# EAGLE design nixie-clock (EAGLE 9.6.0)
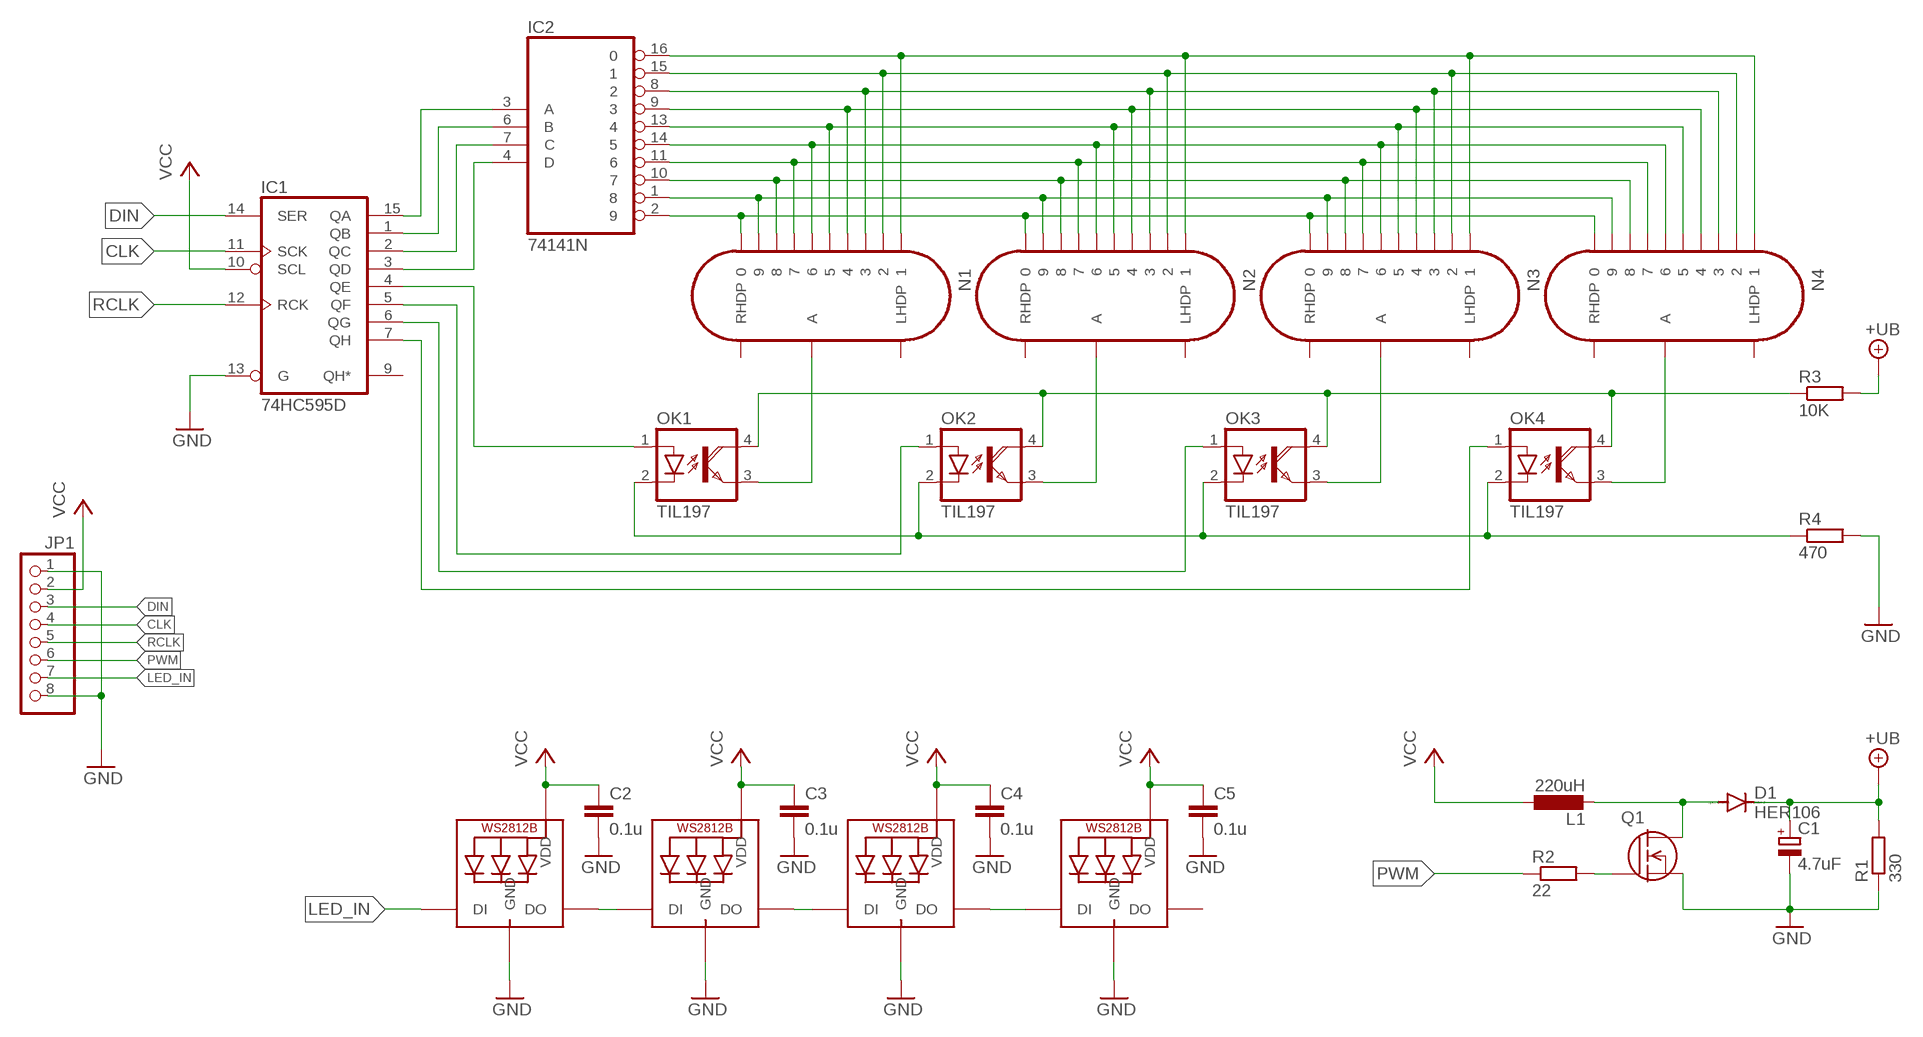
[diagram p0: schematic, sheet 1]

## Parts
C1  4.7uF  CPOL-EUE3.5-8  [E3,5-8]
C2  0.1u  C-EUC0805  [C0805]
C3  0.1u  C-EUC0805  [C0805]
C4  0.1u  C-EUC0805  [C0805]
C5  0.1u  C-EUC0805  [C0805]
D1  HER106  DIODE-DO15-12  [DO15-12]
IC1  74HC595D  [SO16]
IC2  74141N  [DIL16]
JP1  PINHD-1X8  [1X08]
L1  220uH  L-EU6000-XXX-RC  [6000-XXXX-RC]
LED1  WS2812B_5050N  [WS2812B-NARROW]
LED2  WS2812B_5050N  [WS2812B-NARROW]
LED3  WS2812B_5050N  [WS2812B-NARROW]
LED4  WS2812B_5050N  [WS2812B-NARROW]
N1  IN-14  [IN-14]
N2  IN-14  [IN-14]
N3  IN-14  [IN-14]
N4  IN-14  [IN-14]
OK1  TIL197  [DIL04]
OK2  TIL197  [DIL04]
OK3  TIL197  [DIL04]
OK4  TIL197  [DIL04]
Q1  IRF840  [TO220]
R1  330  R-EU_0207/7  [0207/7]
R2  22  R-EU_0207/7  [0207/7]
R3  10K  R-EU_0207/7  [0207/7]
R4  470  R-EU_0207/7  [0207/7]

## Nets
+UB [HV]: C1.+ D1.C R1.2 R3.2
CLK: IC1.11(SCK) JP1.4
DIN: IC1.14(SER) JP1.3
GND [GND]: C1.- C2.2 C3.2 C4.2 C5.2 IC1.13(G) JP1.1 JP1.8 LED1.3-GND(GND) LED2.3-GND(GND) LED3.3-GND(GND) LED4.3-GND(GND) Q1.3(S) R1.1 R4.2
LED_IN: JP1.7 LED1.4-DIN(DI)
N1_ANODE [HV]: N1.A OK1.3(EMI)
N2_ANODE [HV]: N2.A OK2.3(EMI)
N3_ANODE [HV]: N3.A OK3.3(EMI)
N4_ANODE [HV]: N4.A OK4.3(EMI)
N$1: Q1.1(G) R2.2
N$2 [HV]: D1.A L1.2 Q1.2(D)
N$8: IC2.16 N1.1 N2.1 N3.1 N4.1
N$9: IC2.15 N1.2 N2.2 N3.2 N4.2
N$10: IC2.8 N1.3 N2.3 N3.3 N4.3
N$11: IC2.9 N1.4 N2.4 N3.4 N4.4
N$12: IC2.13 N1.5 N2.5 N3.5 N4.5
N$13: IC2.14 N1.6 N2.6 N3.6 N4.6
N$14: IC2.11 N1.7 N2.7 N3.7 N4.7
N$15: IC2.10 N1.8 N2.8 N3.8 N4.8
N$16: IC2.1 N1.9 N2.9 N3.9 N4.9
N$17: IC2.2 N1.0 N2.0 N3.0 N4.0
N$18 [HV]: OK1.4(COL) OK2.4(COL) OK3.4(COL) OK4.4(COL) R3.1
N$19: OK1.2(C) OK2.2(C) OK3.2(C) OK4.2(C) R4.1
N$20: IC1.4(QE) OK1.1(A)
N$21: LED1.2-DOUT(DO) LED2.4-DIN(DI)
N$22: IC1.6(QG) OK3.1(A)
N$23: IC1.7(QH) OK4.1(A)
N$24: IC1.15(QA) IC2.3(A)
N$25: IC1.1(QB) IC2.6(B)
N$26: IC1.2(QC) IC2.7(C)
N$27: IC1.3(QD) IC2.4(D)
N$28: IC1.5(QF) OK2.1(A)
N$29: LED2.2-DOUT(DO) LED3.4-DIN(DI)
N$30: LED3.2-DOUT(DO) LED4.4-DIN(DI)
PWM: JP1.6 R2.1
RCLK: IC1.12(RCK) JP1.5
VCC [VCC]: C2.1 C3.1 C4.1 C5.1 IC1.10(SCL) JP1.2 L1.1 LED1.1-VDD(VDD) LED2.1-VDD(VDD) LED3.1-VDD(VDD) LED4.1-VDD(VDD)
Unconnected: IC1.9(QH*) LED4.2-DOUT(DO) N1.LHDP N1.RHDP N2.LHDP N2.RHDP N3.LHDP N3.RHDP N4.LHDP N4.RHDP

## Power pins joined to a net without a drawn wire
GND: IC1.8(GND) IC2.12(GND)
VCC: IC1.16(VCC) IC2.5(VCC)

## Library data of the parts
C1 = rcl:CPOL-EU: POLARIZED CAPACITOR, European symbol; SPICEPREFIX: C
C2-C5 = rcl:C-EU: CAPACITOR, European symbol; SPICEPREFIX: C
D1 = diode:DIODE-: DIODE
IC1 = 74xx-eu:74*595: 8-bit SHIFT REGISTER, output latch
IC2 = 74xx-eu:74*141: BCD to decimal DECODER/DRIVER
JP1 = pinhead:PINHD-1X8: PIN HEADER
L1 = rcl:L-EU: INDUCTOR, European symbol; SPICEPREFIX: L
LED1-LED4 = WS2812B:WS2812B; AVAILABILITY: Unavailable; DESCRIPTION: Intelligent Control Led Integrated Light Source Pack Of 10; MF: Worldsemi; MP: WS2812B; PACKAGE: None; PRICE: None
N1-N4 = russian-nixies:IN-14: IN-14: medium numeric frontview nixie tube
OK1-OK4 = optocoupler:TIL197: TEXAS INSTRUMENTS OPTO COUPLER; OC_FARNELL: 1683368; OC_NEWARK: unknown
Q1 = IRF840:IRF840: N-Channel Enhancement MOSFET (HEXFET); 500V; 8A; 0,85Ohm; AVAILABILITY: Unavailable; DESCRIPTION: N-Channel 500V 8A _Tc_ 125W _Tc_ Through Hole TO-220AB; MF: Vishay Siliconix; MP: IRF840; PACKAGE: TO-220 Intersil; PRICE: None
R1-R4 = rcl:R-EU_: RESISTOR, European symbol; SPICEPREFIX: R

## Net classes
0 default: width 0.3 mm
1 GND: width 1 mm
2 HV: width 0.5 mm
3 VCC: width 0.8 mm

## Board
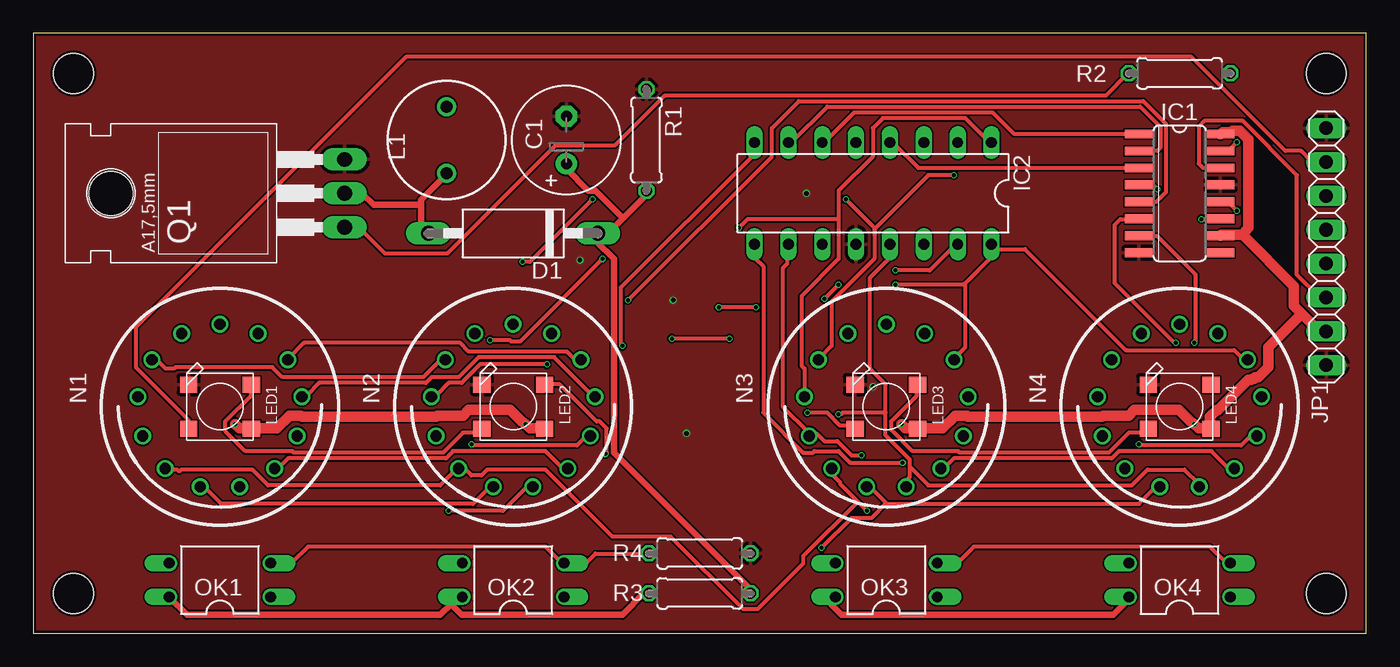
[diagram p1: board, top side]
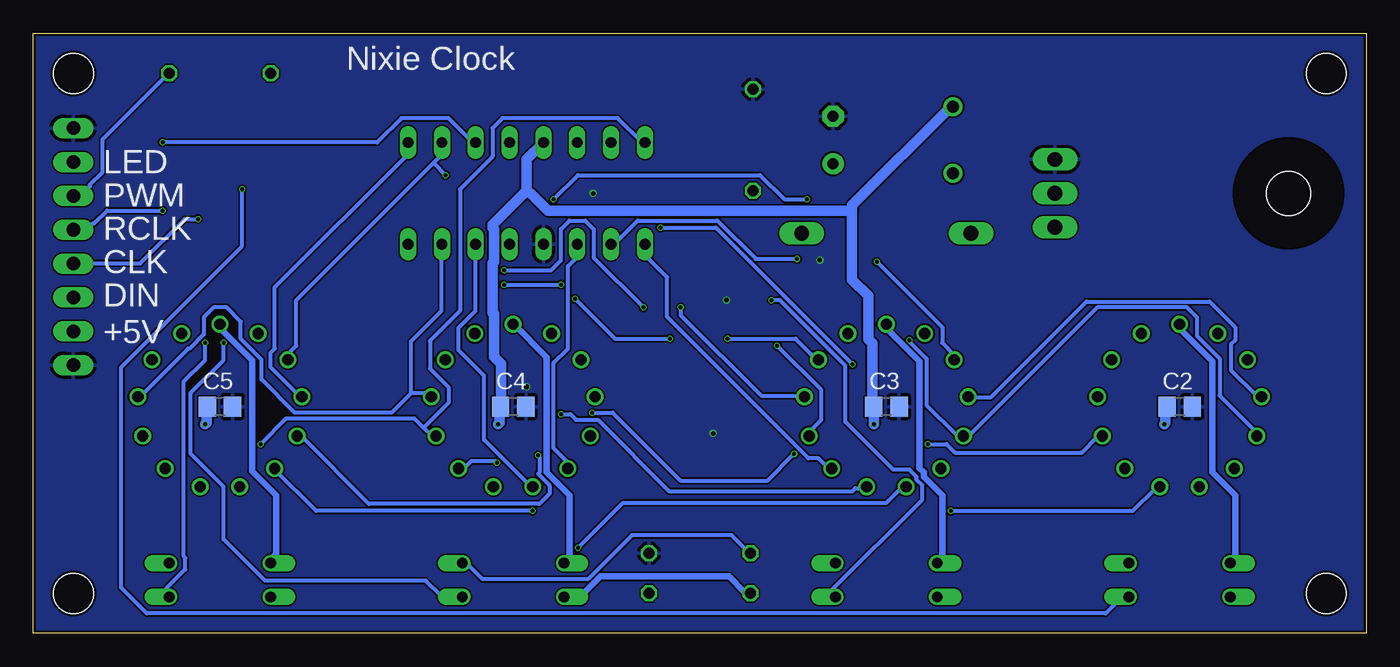
[diagram p2: board, bottom side, seen from below]

Size 100 x 45 mm. Coordinates in mm from the lower left corner, seen from the top.
Outline: 0,0 100,0 100,45 0,45 0,0
Copper layers (1*16): Top 0.035mm / dielectric 1.5mm / Bottom 0.035mm
Design rules "jlcpcb-2layer": minimum track width 5mil, minimum drill 0.3mm, track to track 5mil, track to pad 5mil, pad to pad 5mil, via to via 5mil, smd to smd 5mil, copper to edge 0.2mm, drill to drill 6mil, minimum pad ring 3mil, minimum via ring 3mil, stop-mask expansion 4mil, vias tented up to drill 0.5mm, thermal gap 10mil
Holes 3 mm at 3,3 97,3 3,42 97,42

### Footprints (pad centres in the part's own frame; a part is rotated, then mirrored left to right if it is on the bottom)
E3,5-8 = drill 0.813 pad 1.6: + -1.778,0 | drill 0.813 pad 1.6 octagon: - 1.778,0
C0805 = smd 1.3 x 1.5: 1 -0.95,0; 2 0.95,0
DO15-12 = drill 1.118 long: A 6.35,0; C -6.35,0
SO16 = smd 0.66 x 2.032: 1 -4.445,-3.073; 2 -3.175,-3.073; 3 -1.905,-3.073; 4 -0.635,-3.073; 5 0.635,-3.073; 6 1.905,-3.073; 7 3.175,-3.073; 8 4.445,-3.073; 9 4.445,3.073; 10 3.175,3.073; 11 1.905,3.073; 12 0.635,3.073; 13 -0.635,3.073; 14 -1.905,3.073; 15 -3.175,3.073; 16 -4.445,3.073
DIL16 = drill 0.813 long: 1 -8.89,-3.81; 2 -6.35,-3.81; 3 -3.81,-3.81; 4 -1.27,-3.81; 5 1.27,-3.81; 6 3.81,-3.81; 7 6.35,-3.81; 8 8.89,-3.81; 9 8.89,3.81; 10 6.35,3.81; 11 3.81,3.81; 12 1.27,3.81; 13 -1.27,3.81; 14 -3.81,3.81; 15 -6.35,3.81; 16 -8.89,3.81
1X08 = drill 1.016 long: 1 -8.89,0; 2 -6.35,0; 3 -3.81,0; 4 -1.27,0; 5 1.27,0; 6 3.81,0; 7 6.35,0; 8 8.89,0
6000-XXXX-RC = drill 0.9 pad 1.422: 1 -2.5,0; 2 2.5,0
WS2812B-NARROW = smd 1.3 x 1.2: 1-VDD 2.35,-1.65; 2-DOUT 2.35,1.65; 3-GND -2.35,1.65; 4-DIN -2.35,-1.65
IN-14 = drill 0.84: 0 5.094,-3.516; 1 -5.094,-3.516; 2 -6.145,-0.746; 3 -5.788,2.195; 4 -4.105,4.633; 5 -1.481,6.01; 6 1.481,6.01; 7 4.105,4.633; 8 5.788,2.195; 9 6.145,-0.746; A 0,-6.19; LHDP 2.877,-5.481; RHDP -2.877,-5.481
DIL04 = drill 0.813 offset: 1 -1.27,-3.81; 2 1.27,-3.81; 3 1.27,3.81; 4 -1.27,3.81
TO220 = drill 1.118 long: 1 -2.54,-6.35; 2 0,-6.35; 3 2.54,-6.35 | hole 3.302: 0,11.176
0207/7 = drill 0.813 octagon: 1 -3.81,0; 2 3.81,0

### Placement (x,y rotation side)
C1  40,37 90 top
C2  14,17 0 bottom
C3  36,17 0 bottom
C4  64,17 0 bottom
C5  86,17 0 bottom
D1  36,30 180 top
IC1  86,33 270 top
IC2  63,33 180 top
JP1  97,29 90 top
L1  31,37 270 top
LED1  14,17 0 top
LED2  36,17 0 top
LED3  64,17 0 top
LED4  86,17 0 top
N1  14,17 180 top
N2  36,17 180 top
N3  64,17 180 top
N4  86,17 180 top
OK1  14,4 90 top
OK2  36,4 90 top
OK3  64,4 90 top
OK4  86,4 90 top
Q1  17,33 90 top
R1  46,37 270 top
R2  86,42 180 top
R3  50,3 0 top
R4  50,6 0 top

### Tracks (layer width: path | path; a pad name or v marks a point on that pad's centre or on a via)
+UB
  Top 0.5: R3.2 53.8,3.1 53.8,3.31 43.55,13.56 43.55,28.07 42.27,29.36 42.27,30 D1.C 42.59,30 43.13,30 44.25,31.12 | 44.25,31.12 45.9,32.77 45.9,33.09 R1.2 | 44.25,31.12 42.17,33.2 41.63,33.2 40.03,34.8 40.03,35.12 C1.+
CLK  (via drill 0.3)
  Top 0.3: v87.64,31.06 89.03,31.06 IC1.11
  Bottom 0.3: v87.64,31.06 88.66,31.06 91.97,27.75 96.93,27.75 JP1.4
DIN
  Top 0.3: IC1.14 89.03,34.91 87.75,34.91 87.43,35.23 87.43,38 87.86,38.43 90.74,38.43 94.79,34.37 94.79,26.9 96.5,25.19 96.93,25.19 JP1.3
GND  (via drill 0.35)
  other vias: 48,25 49,15 58,33 41,28 63,18.5
  pour Top: 0,0 0,45 100,45 100,0
  pour Bottom: 0,0 0,45 100,45 100,0
LED_IN
  Top 0.3: LED1.4-DIN 11.64,15.37 11.64,16.01 7.69,19.96 7.69,22.95 27.97,43.23 86.89,43.23 93.94,36.19 95.11,36.19 95.86,35.44 96.93,35.44 JP1.7
N1_ANODE
  Bottom 0.5: OK1.3 10.14,5.34 10.14,5.55 9.82,5.87 9.82,10.36 11.53,12.06 11.53,20.39 13.98,22.84 13.98,23.16 N1.A
N2_ANODE
  Bottom 0.5: OK2.3 32.13,5.34 32.13,5.55 31.81,5.87 31.81,10.36 33.2,11.74 33.2,12.06 33.52,12.38 33.52,20.39 35.98,22.84 35.98,23.16 N2.A
N3_ANODE
  Bottom 0.5: OK3.3 60.1,5.34 60.1,5.55 59.78,5.87 59.78,10.36 61.49,12.06 61.49,20.71 63.94,23.16 N3.A
N4_ANODE
  Bottom 0.5: OK4.3 82.09,5.34 82.09,5.66 81.77,5.98 81.77,10.36 83.58,12.17 83.58,20.5 85.93,22.84 85.93,23.16 N4.A
N$1
  Top 0.3: R2.2 82.09,41.95 80.49,40.35 47.4,40.35 43.66,36.62 39.18,36.62 31.06,28.5 26.37,28.5 24.45,30.42 23.38,30.42 Q1.1
N$2
  Top 0.5: 29.1,32.13 29.1,30.55 D1.A | 29.1,32.13 29.1,32.52 30.74,34.16 30.74,34.27 30.96,34.48 L1.2 | 29.1,32.13 25.51,32.13 24.66,32.99 23.38,32.99 Q1.2
N$8  (via drill 0.3)
  Top 0.3: N1.1 19.11,20.6 20.28,21.78 32.02,21.78 32.67,21.14 40.03,21.14 40.56,20.6 40.99,20.6 N2.1 | 69.92,26.15 69.92,21.46 69.07,20.6 N3.1 | 69.92,26.15 69.92,26.26 71.84,28.18 71.84,29.14 IC2.16 71.95,28.82 74.41,28.82 81.98,21.24 90.1,21.24 90.74,20.6 91.06,20.6 N4.1 | v52.23,22.1 v47.9,22.1 | v60.42,26.15 v59.35,25.09 | 69.92,26.15 v64.69,26.15
  Bottom 0.3: v47.9,22.1 42.81,22.1 41.31,20.6 41.1,20.6 N2.1 | v52.23,22.1 56.36,22.1 v59.35,25.09 | v64.69,26.15 v60.42,26.15
N$9  (via drill 0.3)
  Top 0.3: N1.2 20.18,17.83 20.5,17.83 21.46,18.79 29.46,18.79 29.89,19.21 31.92,19.21 33.41,20.71 39.07,20.71 42.06,17.72 N2.2 | v54.23,24.45 v51.42,24.45 | v64.69,27.22 67.25,27.22 69.28,29.25 IC2.15
  Bottom 0.3: 71.67,18 71.67,21.9 69.39,24.18 69.39,29.14 IC2.15 | 71.67,18 73.12,16.55 80.38,16.55 82.87,19.04 82.87,20.53 84.44,22.1 84.44,23.38 85.51,24.45 86.47,24.45 87.22,23.7 87.22,22.42 88.28,21.35 88.39,21.35 91.91,17.83 92.12,17.83 N4.2 | v51.42,24.45 51.42,23.87 45.38,17.83 42.17,17.83 N2.2 | v54.23,24.45 57.97,28.18 57.97,30.32 58.61,30.96 59.78,30.96 60.42,30.32 60.42,27.97 61.17,27.22 v64.69,27.22 | N3.2 70.14,18 71.67,18
N$10  (via drill 0.3)
  Top 0.3: v82.94,14.2 83.05,14.09 90.63,14.09 91.27,14.73 91.7,14.73 N4.3 | v44.19,21.56 44.09,21.67 44.09,25.94 54.02,35.87 54.02,36.72 IC2.8 | v32.88,14.2 32.99,14.09 40.78,14.09 41.42,14.73 41.74,14.73 N2.3
  Bottom 0.3: 70.72,15.43 71.42,16.12 81.02,16.12 v82.94,14.2 | 70.72,15.43 70.14,14.84 69.81,14.84 N3.3 | v44.19,21.56 40.88,18.25 40.88,16.01 41.74,15.16 41.74,14.84 N2.3 | v32.88,14.2 31.49,14.2 30.85,13.56 21.35,13.56 20.18,14.73 19.86,14.73 N1.3 | 70.72,15.43 68.85,17.29 68.85,18.47 70.24,19.86 70.24,21.94 68,24.18 68,33.31 65.54,35.76 65.54,37.9 64.8,38.64 56.15,38.64 54.34,36.83 54.12,36.83 IC2.8
N$11  (via drill 0.3)
  Top 0.3: N3.4 68.11,12.38 68.32,12.38 69.07,13.13 80.92,13.13 81.45,13.66 88.39,13.66 89.67,12.38 90.1,12.38 N4.4 | N1.4 18.15,12.38 18.36,12.38 19.11,13.13 30.96,13.13 31.49,13.66 38.43,13.66 39.71,12.38 40.03,12.38 N2.4 | v65.22,12.81 61.27,12.81 60.42,13.66 58.61,13.66 58.5,13.56 57.75,13.56 54.76,16.55 54.76,27.54 54.12,28.18 54.12,29.14 IC2.9
  Bottom 0.3: IC2.9 54.02,29.14 54.02,28.29 52.45,26.72 52.45,23.73 41.85,13.13 41.1,13.13 40.35,12.38 40.14,12.38 N2.4 | v65.22,12.81 65.33,12.92 67.15,12.92 67.68,12.38 68,12.38 N3.4
N$12  (via drill 0.3)
  Top 0.3: v31.17,9.18 35.23,9.18 36.94,10.89 37.47,10.89 N2.5 | 63.94,16.55 63.94,14.84 65.76,13.02 65.76,12.38 | 63.94,16.55 63.94,18.68 62.77,19.86 62.77,26.69 64.26,28.18 64.26,29.14 IC2.13 | 65.76,12.38 65.76,11.74 65.54,11.53 65.54,10.99 N3.5 | N4.5 87.43,10.99 87.43,11.21 86.36,12.28 83.58,12.28 82.41,11.1 67.15,11.1 65.86,12.38 65.76,12.38 | v60.42,16.44 60.63,16.44 60.74,16.55 63.94,16.55
  Bottom 0.3: v31.17,9.18 17.51,9.18 15.8,10.89 15.59,10.89 N1.5 | v60.42,16.44 59.71,16.44 59.28,16.01 57.65,16.01 52.31,10.68 38.54,10.68 38.32,10.89 37.58,10.89 N2.5
N$13  (via drill 0.3)
  Top 0.3: N1.6 12.6,10.89 12.92,10.89 14.09,9.71 32.99,9.71 34.16,10.89 34.48,10.89 N2.6 | 64.05,9.71 82.94,9.71 84.12,10.89 84.44,10.89 N4.6 | 64.05,9.71 62.88,10.89 62.56,10.89 N3.6 | v59.14,6.41 61.38,8.65 62.88,8.65 63.94,9.71 64.05,9.71
  Bottom 0.3: IC2.14 66.83,29.14 66.83,24.18 68.11,22.9 68.11,21.24 66.19,19.32 66.19,14.52 62.56,10.89 N3.6 | v59.14,6.41 55.75,9.79 36,9.79 34.91,10.89 34.59,10.89 N2.6
N$14  (via drill 0.3)
  Top 0.3: N1.7 9.93,12.28 10.78,12.28 10.89,12.17 10.99,12.17 11.1,12.28 16.44,12.28 17.61,11.1 30.53,11.1 31.81,12.38 N2.7 32.02,12.28 32.45,12.28 32.88,11.85 33.63,11.85 34.05,12.28 38.43,12.28 43.45,7.26 47.82,7.26 53.27,1.81 54.34,1.81 57.75,5.23 57.75,5.76 61.86,9.87 | 61.86,9.87 60.53,11.21 60.53,11.32 59.99,11.85 59.99,12.28 N3.7 | 61.86,9.87 v62.56,9.18
  Bottom 0.3: IC2.11 59.25,29.14 59.25,28.18 59.89,27.54 59.89,21.35 60.95,20.28 60.95,13.88 59.99,12.92 59.99,12.38 N3.7 | v62.56,9.18 78.78,9.18 81.88,12.28 N4.7
N$15  (via drill 0.3)
  Top 0.3: IC2.10 56.58,29.14 56.58,27.75 56.26,27.43 56.26,16.97 58.18,15.05 58.18,14.84 N3.8 58.28,14.84 58.71,14.84 58.82,14.95 59.35,14.41 60.31,14.41 61.38,13.34 v62.13,13.34 | v34.27,21.99 35.76,21.99 35.87,21.88 36.51,21.88 v42.7,28.07
  Bottom 0.3: N1.8 8.22,14.84 8.22,15.05 10.99,17.83 10.99,20.6 12.7,22.31 12.7,23.7 13.45,24.45 20.18,24.45 29.78,14.84 30.21,14.84 | 30.21,14.84 N2.8 | v62.13,13.34 62.02,13.24 62.02,12.06 62.13,11.96 61.27,11.1 61.27,10.46 62.02,9.71 74.83,9.71 79.85,14.73 80.17,14.73 N4.8 | 30.21,14.84 30.72,14.84 32.99,17.11 32.99,20.6 34.27,21.88 v34.27,21.99 | v42.7,28.07 45.8,28.07 48.68,30.96 54.66,30.96 56.36,29.25 56.58,29.25 IC2.10
N$16  (via drill 0.3)
  Top 0.3: 60.42,31.06 60.42,33.2 62.98,35.76 62.98,37.9 63.73,38.64 69.92,38.64 71.84,36.72 IC2.1 | 60.42,31.06 60.42,28.07 57.65,25.3 57.65,20.07 57.86,19.86 57.86,17.83 N3.9 | v38.54,20.18 33.52,20.18 32.13,18.79 31.17,18.79 30.21,17.83 29.89,17.83 N2.9 | v52.95,30.42 53.59,31.06 60.42,31.06
  Bottom 0.3: N1.9 7.9,17.83 8.22,17.83 10.14,19.75 10.14,21.67 9.82,21.99 9.82,22.95 11.74,24.87 20.99,24.87 28.14,17.72 29.78,17.72 N2.9 | IC2.1 71.95,36.72 71.95,35.87 81.88,25.94 81.88,21.35 82.2,21.03 82.2,19.96 79.96,17.72 N4.9 | v38.54,20.18 48.78,30.42 v52.95,30.42
N$17  (via drill 0.3)
  Top 0.3: N1.0 8.97,20.5 9.29,20.5 9.93,19.86 10.57,19.86 10.68,19.96 17.93,19.96 18.68,19.21 29.25,19.21 30.53,20.5 30.85,20.5 N2.0 | 63.09,30.32 63.09,28.07 59.89,24.87 59.89,21.56 58.93,20.6 N3.0 | 63.09,30.32 67.15,34.37 v69.07,34.37 | v36.72,27.86 37.26,27.86 v41.95,32.56 | v60.95,32.56 63.09,30.42 63.09,30.32
  Bottom 0.3: 69.97,35.28 80.28,24.98 80.28,21.56 80.81,21.03 80.81,20.6 N4.0 | 69.97,35.28 69.39,35.87 69.39,36.72 IC2.2 | 69.97,35.28 v69.07,34.37 | v36.72,27.86 31.81,22.95 31.81,21.78 30.96,20.92 30.96,20.6 N2.0 | v41.95,32.56 43.66,32.56 45.48,34.37 59.14,34.37 v60.95,32.56
N$18
  Top 0.5: 31.33,2.19 31.81,2.67 32.13,2.67 OK2.4 | 31.33,2.19 30.53,1.39 11.53,1.39 10.25,2.67 OK1.4 | OK4.4 82.09,2.67 82.09,2.46 81.02,1.39 60.63,1.39 59.89,2.13 59.89,2.46 60.1,2.67 OK3.4 | 31.33,2.19 32.13,1.39 44.19,1.39 45.8,2.99 46.12,2.99 R3.1
  Bottom 0.5: R3.1 46.22,3.1 46.65,3.1 47.82,4.27 57.43,4.27 58.93,2.78 60.1,2.78 OK3.4
N$19
  Top 0.3: OK3.2 67.89,5.34 69.39,5.34 70.56,6.51 88.28,6.51 89.46,5.34 89.78,5.34 OK4.2 | OK1.2 17.83,5.34 19.43,5.34 20.6,6.51 38.43,6.51 39.71,5.23 OK2.2 39.92,5.34 41.53,5.34 42.17,5.98 46.12,5.98 R4.1
  Bottom 0.3: OK3.2 67.79,5.23 67.47,5.23 66.29,4.06 58.39,4.06 55.08,7.37 47.61,7.37 46.22,5.98 R4.1
N$20  (via drill 0.3)
  Top 0.3: v84.33,33.31 84.01,33.63 82.94,33.63 IC1.4
  Bottom 0.3: v84.33,33.31 84.33,29.04 93.41,19.96 93.41,3.42 91.48,1.49 19.54,1.49 18.36,2.67 17.83,2.67 OK1.1
N$21
  Top 0.3: LED1.2-DOUT 16.33,18.57 16.33,17.83 14.41,15.91 14.41,15.16 15.91,13.66 19.43,13.66 19.54,13.56 30.74,13.56 32.24,15.05 33.41,15.05 33.63,15.27 LED2.4-DIN
N$22  (via drill 0.3)
  Top 0.3: v85.72,21.78 85.61,21.78 81.13,26.26 81.13,30.64 81.56,31.06 82.84,31.06 IC1.6
  Bottom 0.3: v85.72,21.78 85.72,20.5 88.17,18.04 88.17,13.45 85.72,10.99 85.72,7.04 82.62,3.95 70.56,3.95 69.39,2.78 67.89,2.78 OK3.1
N$23  (via drill 0.3)
  Top 0.3: v87.11,21.78 87.22,21.88 87.22,26.9 84.33,29.78 82.94,29.78 IC1.7
  Bottom 0.3: v87.11,21.78 87.11,20.5 88.71,18.9 88.71,5.76 88.6,5.66 88.6,4.8 89.99,3.42 89.99,2.88 89.88,2.78 OK4.1
N$24  (via drill 0.3)
  Top 0.3: v90.31,36.83 89.67,36.19 89.14,36.19 IC1.15
  Bottom 0.3: v90.31,36.83 74.19,36.83 72.38,38.64 68.85,38.64 67.04,36.83 66.83,36.83 IC2.3
N$25
  Top 0.3: IC1.1 82.84,37.47 73.55,37.47 71.95,39.07 61.59,39.07 59.25,36.72 IC2.6
N$26
  Top 0.3: IC1.2 82.94,36.19 84.33,36.19 84.55,36.4 84.55,38 83.05,39.5 59.57,39.5 56.9,36.83 56.68,36.83 IC2.7
N$27
  Top 0.3: IC1.3 82.84,34.91 66.4,34.91 64.58,36.72 64.37,36.72 IC2.4
N$28  (via drill 0.3)
  Top 0.3: v44.62,24.98 55.4,35.76 55.4,37.9 57.43,39.92 83.27,39.92 84.97,38.22 84.97,33.09 84.23,32.34 82.94,32.34 IC1.5
  Bottom 0.3: v44.62,24.98 43.98,24.98 39.07,20.07 39.07,15.87 35.48,12.28 34.27,12.28 33.73,11.74 33.73,11.53 33.31,11.1 33.31,10.03 40.14,3.2 40.14,3.1 39.82,2.78 OK2.1
N$29  (via drill 0.3)
  Top 0.3: v42.91,13.45 43.02,13.56 43.02,15.37 42.49,15.91 42.27,15.91 39.5,18.68 38.43,18.68 LED2.2-DOUT | v58.07,16.55 59.57,16.55 60.53,15.59 61.38,15.59 61.59,15.37 LED3.4-DIN
  Bottom 0.3: v42.91,13.45 44.91,11.45 51.44,11.45 56.54,16.55 v58.07,16.55
N$30
  Top 0.3: LED3.2-DOUT 66.29,18.57 66.29,17.83 64.37,15.91 64.37,15.27 65.97,13.66 69.39,13.66 69.49,13.56 80.7,13.56 82.2,15.05 83.37,15.05 83.58,15.27 LED4.4-DIN
PWM
  Bottom 0.3: R2.1 89.88,41.95 94.79,37.04 94.79,34.59 95.75,33.63 95.75,33.52 96.39,32.88 96.93,32.88 JP1.6
RCLK  (via drill 0.3)
  Top 0.3: v90.31,31.7 89.67,32.34 89.14,32.34 IC1.12
  Bottom 0.3: v90.31,31.7 94.47,31.7 95.43,30.74 95.54,30.74 95.97,30.32 96.93,30.32 JP1.5
VCC  (via drill 0.3)
  Top 0.8: v15.16,15.69 15.48,15.37 16.33,15.37 LED1.1-VDD 16.65,15.37 18.25,15.37 19.21,16.33 20.07,16.33 20.18,16.23 30.21,16.23 30.32,16.33 32.24,16.33 32.67,16.76 35.76,16.76 36.62,15.91 v36.94,15.69 37.26,15.37 38.32,15.37 LED2.1-VDD | 90.74,29.89 89.14,29.89 IC1.10 | 90.74,29.89 94.58,26.05 94.58,24.55 95.17,23.96 | 95.17,23.96 96.39,22.74 96.93,22.74 JP1.2 | IC1.16 89.14,37.47 89.24,37.58 89.88,37.58 89.99,37.68 90.52,37.68 91.17,37.04 91.17,30.42 90.95,30.21 90.74,29.89 | v65.12,15.69 65.44,15.37 66.29,15.37 LED3.1-VDD 66.72,15.37 68.21,15.37 69.17,16.33 70.03,16.33 70.14,16.23 80.17,16.23 80.28,16.33 82.2,16.33 82.62,16.76 85.93,16.76 86.79,15.91 v87.11,15.69 87.43,15.37 88.28,15.37 LED4.1-VDD 88.28,15.69 88.28,16.23 88.82,16.76 88.92,16.76 91.17,19 91.38,19 91.48,19.11 91.59,19.11 91.7,19.21 91.91,19.21 92.66,19.96 92.66,21.46 95.17,23.96
  Bottom 0.8: v15.16,15.69 15.05,15.8 15.05,16.97 C2.1 | v36.94,15.69 36.94,16.97 C3.1 37.04,17.4 37.04,21.75 37.36,22.07 37.36,25.31 38.58,26.52 38.58,31.7 | 38.58,31.7 38.58,32.09 31.17,39.5 31.06,39.5 L1.1 | v65.12,15.69 65.01,15.8 65.01,16.97 C4.1 64.9,17.4 64.9,20.2 65.44,20.74 65.44,23.95 65.54,24.06 65.54,27.75 65.44,27.86 65.44,30.32 65.54,30.42 65.54,30.64 62.98,33.2 | v87.11,15.69 87,15.8 87,16.97 C5.1 | 62.98,33.2 62.98,35.55 61.81,36.72 IC2.5 | 38.58,31.7 61.38,31.7 62.66,32.99 62.98,33.2

### Text on the board
bNames: Nixie Clock | LED | PWM | RCLK | CLK | DIN | +5V